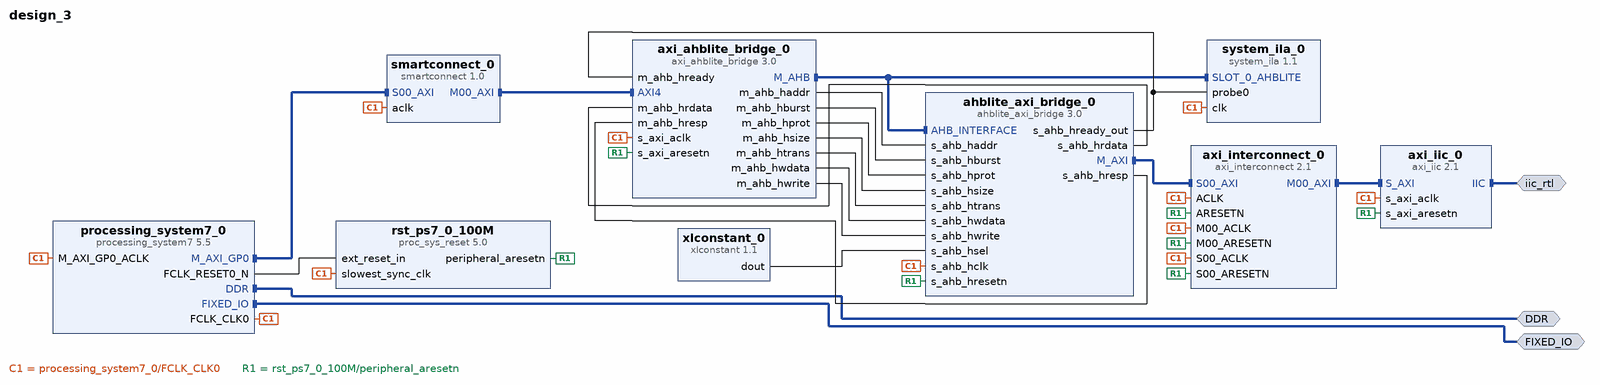
[diagram p0: block diagram of the top level]
# Vivado block design design_3, xc7z020clg400-1, Vivado 2025.1
create_bd_design design_3

create_bd_intf_port -mode Master -vlnv xilinx.com:interface:ddrx_rtl:1.0 DDR
create_bd_intf_port -mode Master -vlnv xilinx.com:display_processing_system7:fixedio_rtl:1.0 FIXED_IO
create_bd_intf_port -mode Master -vlnv xilinx.com:interface:iic_rtl:1.0 iic_rtl

create_bd_cell -type ip -vlnv xilinx.com:ip:ahblite_axi_bridge:3.0 ahblite_axi_bridge_0
create_bd_cell -type ip -vlnv xilinx.com:ip:axi_ahblite_bridge:3.0 axi_ahblite_bridge_0
create_bd_cell -type ip -vlnv xilinx.com:ip:processing_system7:5.5 processing_system7_0
set_property -dict [list \
  CONFIG.PCW_APU_PERIPHERAL_FREQMHZ 650 \
  CONFIG.PCW_CRYSTAL_PERIPHERAL_FREQMHZ 50 \
  CONFIG.PCW_ENET0_ENET0_IO {MIO 16 .. 27} \
  CONFIG.PCW_ENET0_GRP_MDIO_ENABLE 1 \
  CONFIG.PCW_ENET0_GRP_MDIO_IO {MIO 52 .. 53} \
  CONFIG.PCW_ENET0_PERIPHERAL_ENABLE 1 \
  CONFIG.PCW_ENET0_RESET_ENABLE 1 \
  CONFIG.PCW_ENET0_RESET_IO {MIO 9} \
  CONFIG.PCW_ENET_RESET_ENABLE 1 \
  CONFIG.PCW_ENET_RESET_SELECT {Share reset pin} \
  CONFIG.PCW_FPGA0_PERIPHERAL_FREQMHZ 100 \
  CONFIG.PCW_FPGA1_PERIPHERAL_FREQMHZ 50 \
  CONFIG.PCW_GPIO_MIO_GPIO_ENABLE 1 \
  CONFIG.PCW_GPIO_MIO_GPIO_IO MIO \
  CONFIG.PCW_I2C_RESET_ENABLE 1 \
  CONFIG.PCW_M_AXI_GP0_FREQMHZ 10 \
  CONFIG.PCW_PERIPHERAL_BOARD_PRESET None \
  CONFIG.PCW_PRESET_BANK1_VOLTAGE {LVCMOS 1.8V} \
  CONFIG.PCW_QSPI_GRP_FBCLK_ENABLE 1 \
  CONFIG.PCW_QSPI_GRP_FBCLK_IO {MIO 8} \
  CONFIG.PCW_QSPI_GRP_SINGLE_SS_ENABLE 1 \
  CONFIG.PCW_QSPI_GRP_SINGLE_SS_IO {MIO 1 .. 6} \
  CONFIG.PCW_QSPI_PERIPHERAL_ENABLE 1 \
  CONFIG.PCW_QSPI_QSPI_IO {MIO 1 .. 6} \
  CONFIG.PCW_SD0_GRP_CD_ENABLE 1 \
  CONFIG.PCW_SD0_GRP_CD_IO {MIO 47} \
  CONFIG.PCW_SD0_GRP_WP_ENABLE 0 \
  CONFIG.PCW_SD0_PERIPHERAL_ENABLE 1 \
  CONFIG.PCW_SD0_SD0_IO {MIO 40 .. 45} \
  CONFIG.PCW_SDIO_PERIPHERAL_FREQMHZ 50 \
  CONFIG.PCW_SINGLE_QSPI_DATA_MODE x4 \
  CONFIG.PCW_UART0_PERIPHERAL_ENABLE 1 \
  CONFIG.PCW_UART0_UART0_IO {MIO 14 .. 15} \
  CONFIG.PCW_UART1_PERIPHERAL_ENABLE 0 \
  CONFIG.PCW_UART_PERIPHERAL_FREQMHZ 100 \
  CONFIG.PCW_UIPARAM_DDR_BUS_WIDTH {16 Bit} \
  CONFIG.PCW_UIPARAM_DDR_FREQ_MHZ 525 \
  CONFIG.PCW_UIPARAM_DDR_PARTNO {MT41J256M16 RE-125} \
  CONFIG.PCW_USB0_PERIPHERAL_ENABLE 1 \
  CONFIG.PCW_USB0_RESET_ENABLE 1 \
  CONFIG.PCW_USB0_RESET_IO {MIO 46} \
  CONFIG.PCW_USB0_USB0_IO {MIO 28 .. 39} \
  CONFIG.PCW_USB_RESET_ENABLE 1 \
  CONFIG.PCW_USB_RESET_SELECT {Share reset pin} \
] [get_bd_cells processing_system7_0]
# 481 more settings of processing_system7_0 are not shown: defaults, MIO pin electricals, DDR timing, and values the tool derives
create_bd_cell -type ip -vlnv xilinx.com:ip:smartconnect:1.0 smartconnect_0
create_bd_cell -type ip -vlnv xilinx.com:ip:axi_iic:2.1 axi_iic_0
set_property -dict {CONFIG.IIC_BOARD_INTERFACE Custom CONFIG.USE_BOARD_FLOW true} [get_bd_cells axi_iic_0]
create_bd_cell -type ip -vlnv xilinx.com:ip:proc_sys_reset:5.0 rst_ps7_0_100M
create_bd_cell -type ip -vlnv xilinx.com:ip:system_ila:1.1 system_ila_0
set_property -dict [list \
  CONFIG.C_EN_STRG_QUAL 1 \
  CONFIG.C_MON_TYPE MIX \
  CONFIG.C_NUM_MONITOR_SLOTS 1 \
  CONFIG.C_NUM_OF_PROBES 1 \
  CONFIG.C_PROBE0_TYPE 0 \
  CONFIG.C_SLOT_0_INTF_TYPE xilinx.com:interface:ahblite_rtl:2.0 \
  CONFIG.C_SLOT_0_TYPE 0 \
] [get_bd_cells system_ila_0]
create_bd_cell -type ip -vlnv xilinx.com:ip:xlconstant:1.1 xlconstant_0
create_bd_cell -type ip -vlnv xilinx.com:ip:axi_interconnect:2.1 axi_interconnect_0
set_property -dict {CONFIG.NUM_MI 1} [get_bd_cells axi_interconnect_0]

# ---- connections ----

connect_bd_intf_net [get_bd_intf_pins ahblite_axi_bridge_0/M_AXI] [get_bd_intf_pins axi_interconnect_0/S00_AXI]
connect_bd_intf_net -intf_net axi_ahblite_bridge_0_M_AHB [get_bd_intf_pins ahblite_axi_bridge_0/AHB_INTERFACE] [get_bd_intf_pins axi_ahblite_bridge_0/M_AHB]
connect_bd_intf_net [get_bd_intf_pins ahblite_axi_bridge_0/AHB_INTERFACE] [get_bd_intf_pins system_ila_0/SLOT_0_AHBLITE]
connect_bd_intf_net [get_bd_intf_ports iic_rtl] [get_bd_intf_pins axi_iic_0/IIC]
connect_bd_intf_net [get_bd_intf_pins axi_interconnect_0/M00_AXI] [get_bd_intf_pins axi_iic_0/S_AXI]
connect_bd_intf_net [get_bd_intf_ports DDR] [get_bd_intf_pins processing_system7_0/DDR]
connect_bd_intf_net [get_bd_intf_ports FIXED_IO] [get_bd_intf_pins processing_system7_0/FIXED_IO]
connect_bd_intf_net [get_bd_intf_pins processing_system7_0/M_AXI_GP0] [get_bd_intf_pins smartconnect_0/S00_AXI]
connect_bd_intf_net [get_bd_intf_pins axi_ahblite_bridge_0/AXI4] [get_bd_intf_pins smartconnect_0/M00_AXI]
connect_bd_net [get_bd_pins ahblite_axi_bridge_0/s_ahb_hrdata] [get_bd_pins axi_ahblite_bridge_0/m_ahb_hrdata]
connect_bd_net -net ahblite_axi_bridge_0_s_ahb_hready_out [get_bd_pins ahblite_axi_bridge_0/s_ahb_hready_out] \
  [get_bd_pins axi_ahblite_bridge_0/m_ahb_hready] [get_bd_pins system_ila_0/probe0]
connect_bd_net [get_bd_pins ahblite_axi_bridge_0/s_ahb_hresp] [get_bd_pins axi_ahblite_bridge_0/m_ahb_hresp]
connect_bd_net [get_bd_pins axi_ahblite_bridge_0/m_ahb_haddr] [get_bd_pins ahblite_axi_bridge_0/s_ahb_haddr]
connect_bd_net [get_bd_pins axi_ahblite_bridge_0/m_ahb_hburst] [get_bd_pins ahblite_axi_bridge_0/s_ahb_hburst]
connect_bd_net [get_bd_pins axi_ahblite_bridge_0/m_ahb_hprot] [get_bd_pins ahblite_axi_bridge_0/s_ahb_hprot]
connect_bd_net [get_bd_pins axi_ahblite_bridge_0/m_ahb_hsize] [get_bd_pins ahblite_axi_bridge_0/s_ahb_hsize]
connect_bd_net [get_bd_pins axi_ahblite_bridge_0/m_ahb_htrans] [get_bd_pins ahblite_axi_bridge_0/s_ahb_htrans]
connect_bd_net [get_bd_pins axi_ahblite_bridge_0/m_ahb_hwdata] [get_bd_pins ahblite_axi_bridge_0/s_ahb_hwdata]
connect_bd_net [get_bd_pins axi_ahblite_bridge_0/m_ahb_hwrite] [get_bd_pins ahblite_axi_bridge_0/s_ahb_hwrite]
connect_bd_net [get_bd_pins processing_system7_0/FCLK_CLK0] \
  [get_bd_pins ahblite_axi_bridge_0/s_ahb_hclk] [get_bd_pins axi_ahblite_bridge_0/s_axi_aclk] \
  [get_bd_pins rst_ps7_0_100M/slowest_sync_clk] [get_bd_pins axi_iic_0/s_axi_aclk] \
  [get_bd_pins processing_system7_0/M_AXI_GP0_ACLK] [get_bd_pins smartconnect_0/aclk] [get_bd_pins system_ila_0/clk] \
  [get_bd_pins axi_interconnect_0/ACLK] [get_bd_pins axi_interconnect_0/S00_ACLK] [get_bd_pins axi_interconnect_0/M00_ACLK]
connect_bd_net [get_bd_pins processing_system7_0/FCLK_RESET0_N] [get_bd_pins rst_ps7_0_100M/ext_reset_in]
connect_bd_net [get_bd_pins rst_ps7_0_100M/peripheral_aresetn] \
  [get_bd_pins ahblite_axi_bridge_0/s_ahb_hresetn] [get_bd_pins axi_ahblite_bridge_0/s_axi_aresetn] \
  [get_bd_pins axi_iic_0/s_axi_aresetn] [get_bd_pins axi_interconnect_0/M00_ARESETN] [get_bd_pins axi_interconnect_0/ARESETN] \
  [get_bd_pins axi_interconnect_0/S00_ARESETN]
connect_bd_net [get_bd_pins xlconstant_0/dout] [get_bd_pins ahblite_axi_bridge_0/s_ahb_hsel]
set_property HDL_ATTRIBUTE.DEBUG true [get_bd_intf_nets axi_ahblite_bridge_0_M_AHB]
set_property HDL_ATTRIBUTE.MARK_DEBUG true [get_bd_intf_nets axi_ahblite_bridge_0_M_AHB]
set_property HDL_ATTRIBUTE.DEBUG true [get_bd_nets ahblite_axi_bridge_0_s_ahb_hready_out]
set_property HDL_ATTRIBUTE.MARK_DEBUG true [get_bd_nets ahblite_axi_bridge_0_s_ahb_hready_out]

# ---- address map ----
assign_bd_address -offset 0x41600000 -range 64K -target_address_space [get_bd_addr_spaces processing_system7_0/Data] [get_bd_addr_segs axi_iic_0/S_AXI/Reg]

validate_bd_design
save_bd_design
